# Altium schematic sheet TOP.SchDoc
size A; SheetNumber: 1; SheetTotal: 7
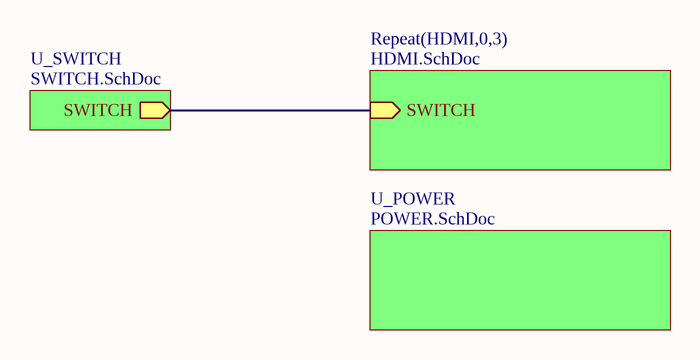
[diagram p0: TOP.SchDoc]

## Sub-sheets
Repeat(HDMI,0,3) = HDMI.SchDoc: SWITCH (in)
U_POWER = POWER.SchDoc: no entries
U_SWITCH = SWITCH.SchDoc: SWITCH (out)

## Nets
(unnamed): sheet Repeat(HDMI,0,3)/SWITCH, sheet U_SWITCH/SWITCH